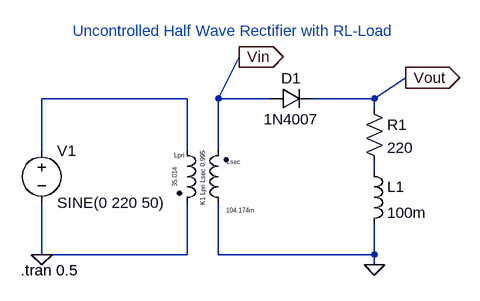
[diagram p0: schematic RLLoad.asc]
RLLoad.asc, the LTspice schematic file:
Version 4
SHEET 1 880 680
WIRE -32 -128 -256 -128
WIRE 16 -128 48 -192
WIRE 96 -128 16 -128
WIRE 256 -128 304 -160
WIRE 256 -128 160 -128
WIRE 256 -112 256 -128
WIRE -256 -48 -256 -128
WIRE -32 -48 -32 -128
WIRE 16 -48 16 -128
WIRE 256 -16 256 -32
WIRE -256 112 -256 32
WIRE -32 112 -32 32
WIRE -32 112 -256 112
WIRE 16 112 16 32
WIRE 256 112 256 64
WIRE 256 112 16 112
WIRE 256 128 256 112
FLAG 304 -160 Vout
IOPIN 304 -160 Out
FLAG -256 112 0
FLAG 48 -192 Vin
IOPIN 48 -192 Out
FLAG 256 128 0
SYMBOL voltage -256 -64 R0
WINDOW 123 0 0 Left 0
WINDOW 39 0 0 Left 0
SYMATTR InstName V1
SYMATTR Value SINE(0 220 50)
SYMBOL ind2 -48 -64 R0
WINDOW 0 -4 23 Left 0
WINDOW 3 -3 72 VLeft 0
SYMATTR InstName Lpri
SYMATTR Value 35.014
SYMATTR Type ind
SYMATTR SpiceLine Rser=0.5
SYMBOL diode 96 -112 R270
WINDOW 0 32 32 VTop 2
WINDOW 3 0 32 VBottom 2
SYMATTR InstName D1
SYMATTR Value 1N4007
SYMBOL res 240 -128 R0
SYMATTR InstName R1
SYMATTR Value 220
SYMBOL ind2 32 48 R180
WINDOW 0 -18 79 Left 0
WINDOW 3 -41 4 Left 0
SYMATTR InstName Lsec
SYMATTR Value 104.174m
SYMATTR Type ind
SYMATTR SpiceLine Rser=0.1
SYMBOL ind 240 -32 R0
SYMATTR InstName L1
SYMATTR Value 100m
TEXT -288 136 Left 2 !.tran 0.5
TEXT -8 -48 VRight 0 !K1 Lpri Lsec 0.995
TEXT -208 -232 Left 2 ;Uncontrolled Half Wave Rectifier with RL-Load

The netlist it stands for:
* RLLoad.asc
V1 N001 0 SINE(0 220 50)
Lpri N001 0 35.014 Rser=0.5
D1 Vin Vout 1N4007
R1 Vout N002 220
Lsec 0 Vin 104.174m Rser=0.1
L1 N002 0 100m
.model D D
.lib standard.dio
.tran 0.5
K1 Lpri Lsec 0.995
* Uncontrolled Half Wave Rectifier with RL-Load
.backanno
.end